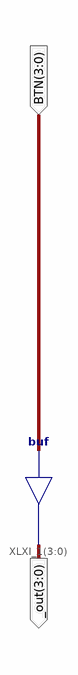
[diagram p0: schematic sheet 1]
// Xilinx ISE schematic Normal_BTN.sch (spartan6) as structural Verilog: 1 symbols, 2 ports
module Normal_BTN (
  input  [3:0] BTN,
  output [3:0] _out
);

  assign _out = BTN;  // buf XLXI_1[3..0], 4 bits wide
endmodule
